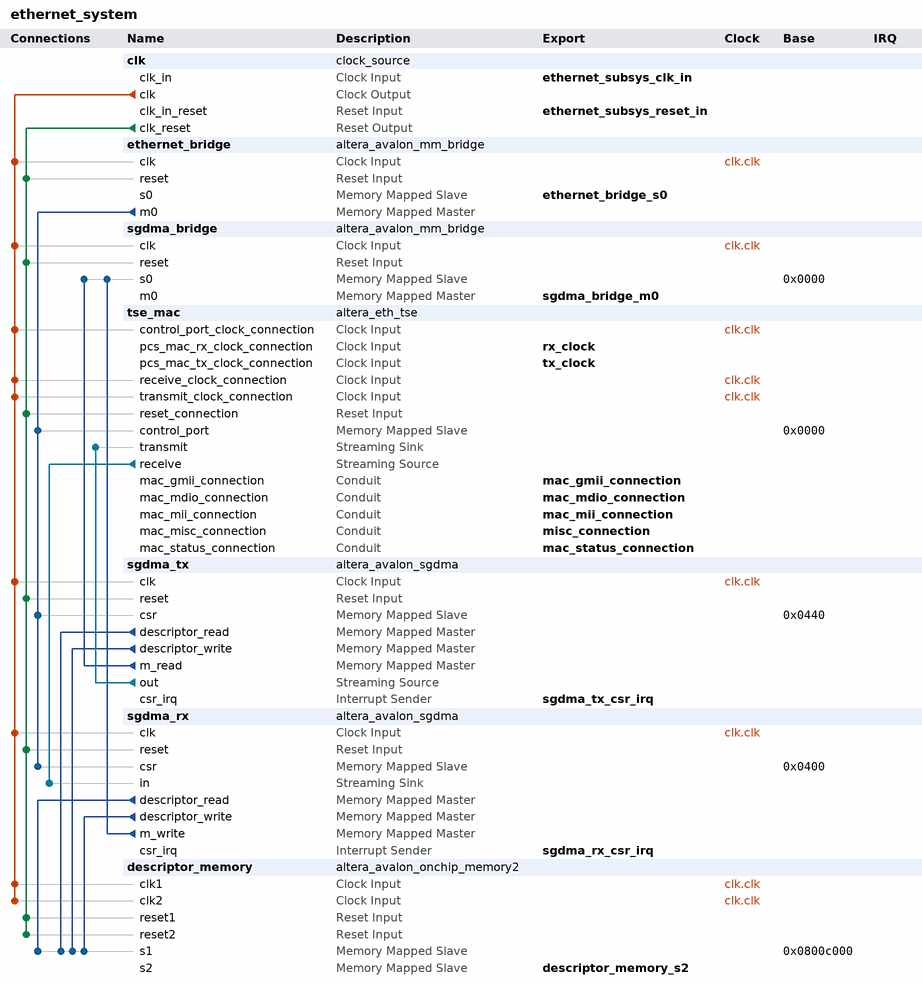
[diagram p0: system contents]
# Platform Designer (Qsys) system ethernet_system, Cyclone V 5CGXFC5C6F27C7
# Parameters at their usual value, and those the tool derives, are not listed.
package require -exact qsys 16.1
create_system ethernet_system
set_project_property DEVICE_FAMILY {Cyclone V}
set_project_property DEVICE 5CGXFC5C6F27C7

add_instance clk clock_source 16.1
set_instance_parameter_value clk clockFrequency 50000000

add_instance ethernet_bridge altera_avalon_mm_bridge 16.1
set_instance_parameter_value ethernet_bridge ADDRESS_UNITS SYMBOLS
set_instance_parameter_value ethernet_bridge ADDRESS_WIDTH 11
set_instance_parameter_value ethernet_bridge DATA_WIDTH 32
set_instance_parameter_value ethernet_bridge MAX_PENDING_RESPONSES 4
set_instance_parameter_value ethernet_bridge USE_AUTO_ADDRESS_WIDTH 0

add_instance sgdma_bridge altera_avalon_mm_bridge 16.1
set_instance_parameter_value sgdma_bridge ADDRESS_UNITS SYMBOLS
set_instance_parameter_value sgdma_bridge ADDRESS_WIDTH 31
set_instance_parameter_value sgdma_bridge DATA_WIDTH 32
set_instance_parameter_value sgdma_bridge MAX_PENDING_RESPONSES 4
set_instance_parameter_value sgdma_bridge USE_AUTO_ADDRESS_WIDTH 0

add_instance tse_mac altera_eth_tse 16.1
set_instance_parameter_value tse_mac core_variation MAC_ONLY
set_instance_parameter_value tse_mac eg_addr 12
set_instance_parameter_value tse_mac ena_hash true
set_instance_parameter_value tse_mac enable_hd_logic true
set_instance_parameter_value tse_mac enable_mac_flow_ctrl true
set_instance_parameter_value tse_mac enable_magic_detect false
set_instance_parameter_value tse_mac enable_shift16 true
set_instance_parameter_value tse_mac ifGMII MII_GMII
set_instance_parameter_value tse_mac ing_addr 12
set_instance_parameter_value tse_mac mdio_clk_div 30
set_instance_parameter_value tse_mac stat_cnt_ena true
set_instance_parameter_value tse_mac transceiver_type NONE

add_instance sgdma_tx altera_avalon_sgdma 16.1
set_instance_parameter_value sgdma_tx enableBurstTransfers false
set_instance_parameter_value sgdma_tx enableUnalignedTransfers false
set_instance_parameter_value sgdma_tx readBlockDataWidth 32
set_instance_parameter_value sgdma_tx sinkErrorWidth 0
set_instance_parameter_value sgdma_tx sourceErrorWidth 1
set_instance_parameter_value sgdma_tx transferMode MEMORY_TO_STREAM
set_instance_parameter_value sgdma_tx writeBurstcountWidth 4

add_instance sgdma_rx altera_avalon_sgdma 16.1
set_instance_parameter_value sgdma_rx enableBurstTransfers false
set_instance_parameter_value sgdma_rx enableUnalignedTransfers false
set_instance_parameter_value sgdma_rx readBlockDataWidth 32
set_instance_parameter_value sgdma_rx sinkErrorWidth 6
set_instance_parameter_value sgdma_rx sourceErrorWidth 0
set_instance_parameter_value sgdma_rx transferMode STREAM_TO_MEMORY
set_instance_parameter_value sgdma_rx writeBurstcountWidth 4

add_instance descriptor_memory altera_avalon_onchip_memory2 16.1
set_instance_parameter_value descriptor_memory dataWidth 32
set_instance_parameter_value descriptor_memory dualPort true
set_instance_parameter_value descriptor_memory initMemContent true
set_instance_parameter_value descriptor_memory initializationFileName onchip_mem.hex
set_instance_parameter_value descriptor_memory memorySize 8192

# connections
add_connection clk.clk descriptor_memory.clk1 clock
add_connection clk.clk descriptor_memory.clk2 clock
add_connection clk.clk ethernet_bridge.clk clock
add_connection clk.clk sgdma_bridge.clk clock
add_connection clk.clk sgdma_rx.clk clock
add_connection clk.clk sgdma_tx.clk clock
add_connection clk.clk tse_mac.control_port_clock_connection clock
add_connection clk.clk tse_mac.receive_clock_connection clock
add_connection clk.clk tse_mac.transmit_clock_connection clock
add_connection clk.clk_reset descriptor_memory.reset1 reset
add_connection clk.clk_reset descriptor_memory.reset2 reset
add_connection clk.clk_reset ethernet_bridge.reset reset
add_connection clk.clk_reset sgdma_bridge.reset reset
add_connection clk.clk_reset sgdma_rx.reset reset
add_connection clk.clk_reset sgdma_tx.reset reset
add_connection clk.clk_reset tse_mac.reset_connection reset
add_connection ethernet_bridge.m0 sgdma_rx.csr avalon
set_connection_parameter_value ethernet_bridge.m0/sgdma_rx.csr baseAddress 0x0400
add_connection ethernet_bridge.m0 sgdma_tx.csr avalon
set_connection_parameter_value ethernet_bridge.m0/sgdma_tx.csr baseAddress 0x0440
add_connection ethernet_bridge.m0 tse_mac.control_port avalon
set_connection_parameter_value ethernet_bridge.m0/tse_mac.control_port baseAddress 0x0000
add_connection sgdma_rx.descriptor_read descriptor_memory.s1 avalon
set_connection_parameter_value sgdma_rx.descriptor_read/descriptor_memory.s1 baseAddress 0x0800c000
add_connection sgdma_rx.descriptor_write descriptor_memory.s1 avalon
set_connection_parameter_value sgdma_rx.descriptor_write/descriptor_memory.s1 baseAddress 0x0800c000
add_connection sgdma_rx.m_write sgdma_bridge.s0 avalon
set_connection_parameter_value sgdma_rx.m_write/sgdma_bridge.s0 baseAddress 0x0000
add_connection sgdma_tx.descriptor_read descriptor_memory.s1 avalon
set_connection_parameter_value sgdma_tx.descriptor_read/descriptor_memory.s1 baseAddress 0x0800c000
add_connection sgdma_tx.descriptor_write descriptor_memory.s1 avalon
set_connection_parameter_value sgdma_tx.descriptor_write/descriptor_memory.s1 baseAddress 0x0800c000
add_connection sgdma_tx.m_read sgdma_bridge.s0 avalon
set_connection_parameter_value sgdma_tx.m_read/sgdma_bridge.s0 baseAddress 0x0000
add_connection sgdma_tx.out tse_mac.transmit avalon_streaming
add_connection tse_mac.receive sgdma_rx.in avalon_streaming

# exported interfaces
add_interface descriptor_memory_s2 avalon slave
set_interface_property descriptor_memory_s2 EXPORT_OF descriptor_memory.s2
add_interface ethernet_bridge_s0 avalon slave
set_interface_property ethernet_bridge_s0 EXPORT_OF ethernet_bridge.s0
add_interface ethernet_subsys_clk_in clock sink
set_interface_property ethernet_subsys_clk_in EXPORT_OF clk.clk_in
add_interface ethernet_subsys_reset_in reset sink
set_interface_property ethernet_subsys_reset_in EXPORT_OF clk.clk_in_reset
add_interface mac_gmii_connection conduit end
set_interface_property mac_gmii_connection EXPORT_OF tse_mac.mac_gmii_connection
add_interface mac_mdio_connection conduit end
set_interface_property mac_mdio_connection EXPORT_OF tse_mac.mac_mdio_connection
add_interface mac_mii_connection conduit end
set_interface_property mac_mii_connection EXPORT_OF tse_mac.mac_mii_connection
add_interface mac_status_connection conduit end
set_interface_property mac_status_connection EXPORT_OF tse_mac.mac_status_connection
add_interface misc_connection conduit end
set_interface_property misc_connection EXPORT_OF tse_mac.mac_misc_connection
add_interface rx_clock clock sink
set_interface_property rx_clock EXPORT_OF tse_mac.pcs_mac_rx_clock_connection
add_interface sgdma_bridge_m0 avalon master
set_interface_property sgdma_bridge_m0 EXPORT_OF sgdma_bridge.m0
add_interface sgdma_rx_csr_irq interrupt sender
set_interface_property sgdma_rx_csr_irq EXPORT_OF sgdma_rx.csr_irq
add_interface sgdma_tx_csr_irq interrupt sender
set_interface_property sgdma_tx_csr_irq EXPORT_OF sgdma_tx.csr_irq
add_interface tx_clock clock sink
set_interface_property tx_clock EXPORT_OF tse_mac.pcs_mac_tx_clock_connection

set_interconnect_requirement {$system} qsys_mm.clockCrossingAdapter HANDSHAKE
set_interconnect_requirement {$system} qsys_mm.enableEccProtection FALSE
set_interconnect_requirement {$system} qsys_mm.insertDefaultSlave FALSE
set_interconnect_requirement {$system} qsys_mm.maxAdditionalLatency 1

save_system ethernet_system.qsys
